# Altium schematic sheet Sixth-Sense-Schematic_2026-08-17.schdoc
size 433 x 310 mm
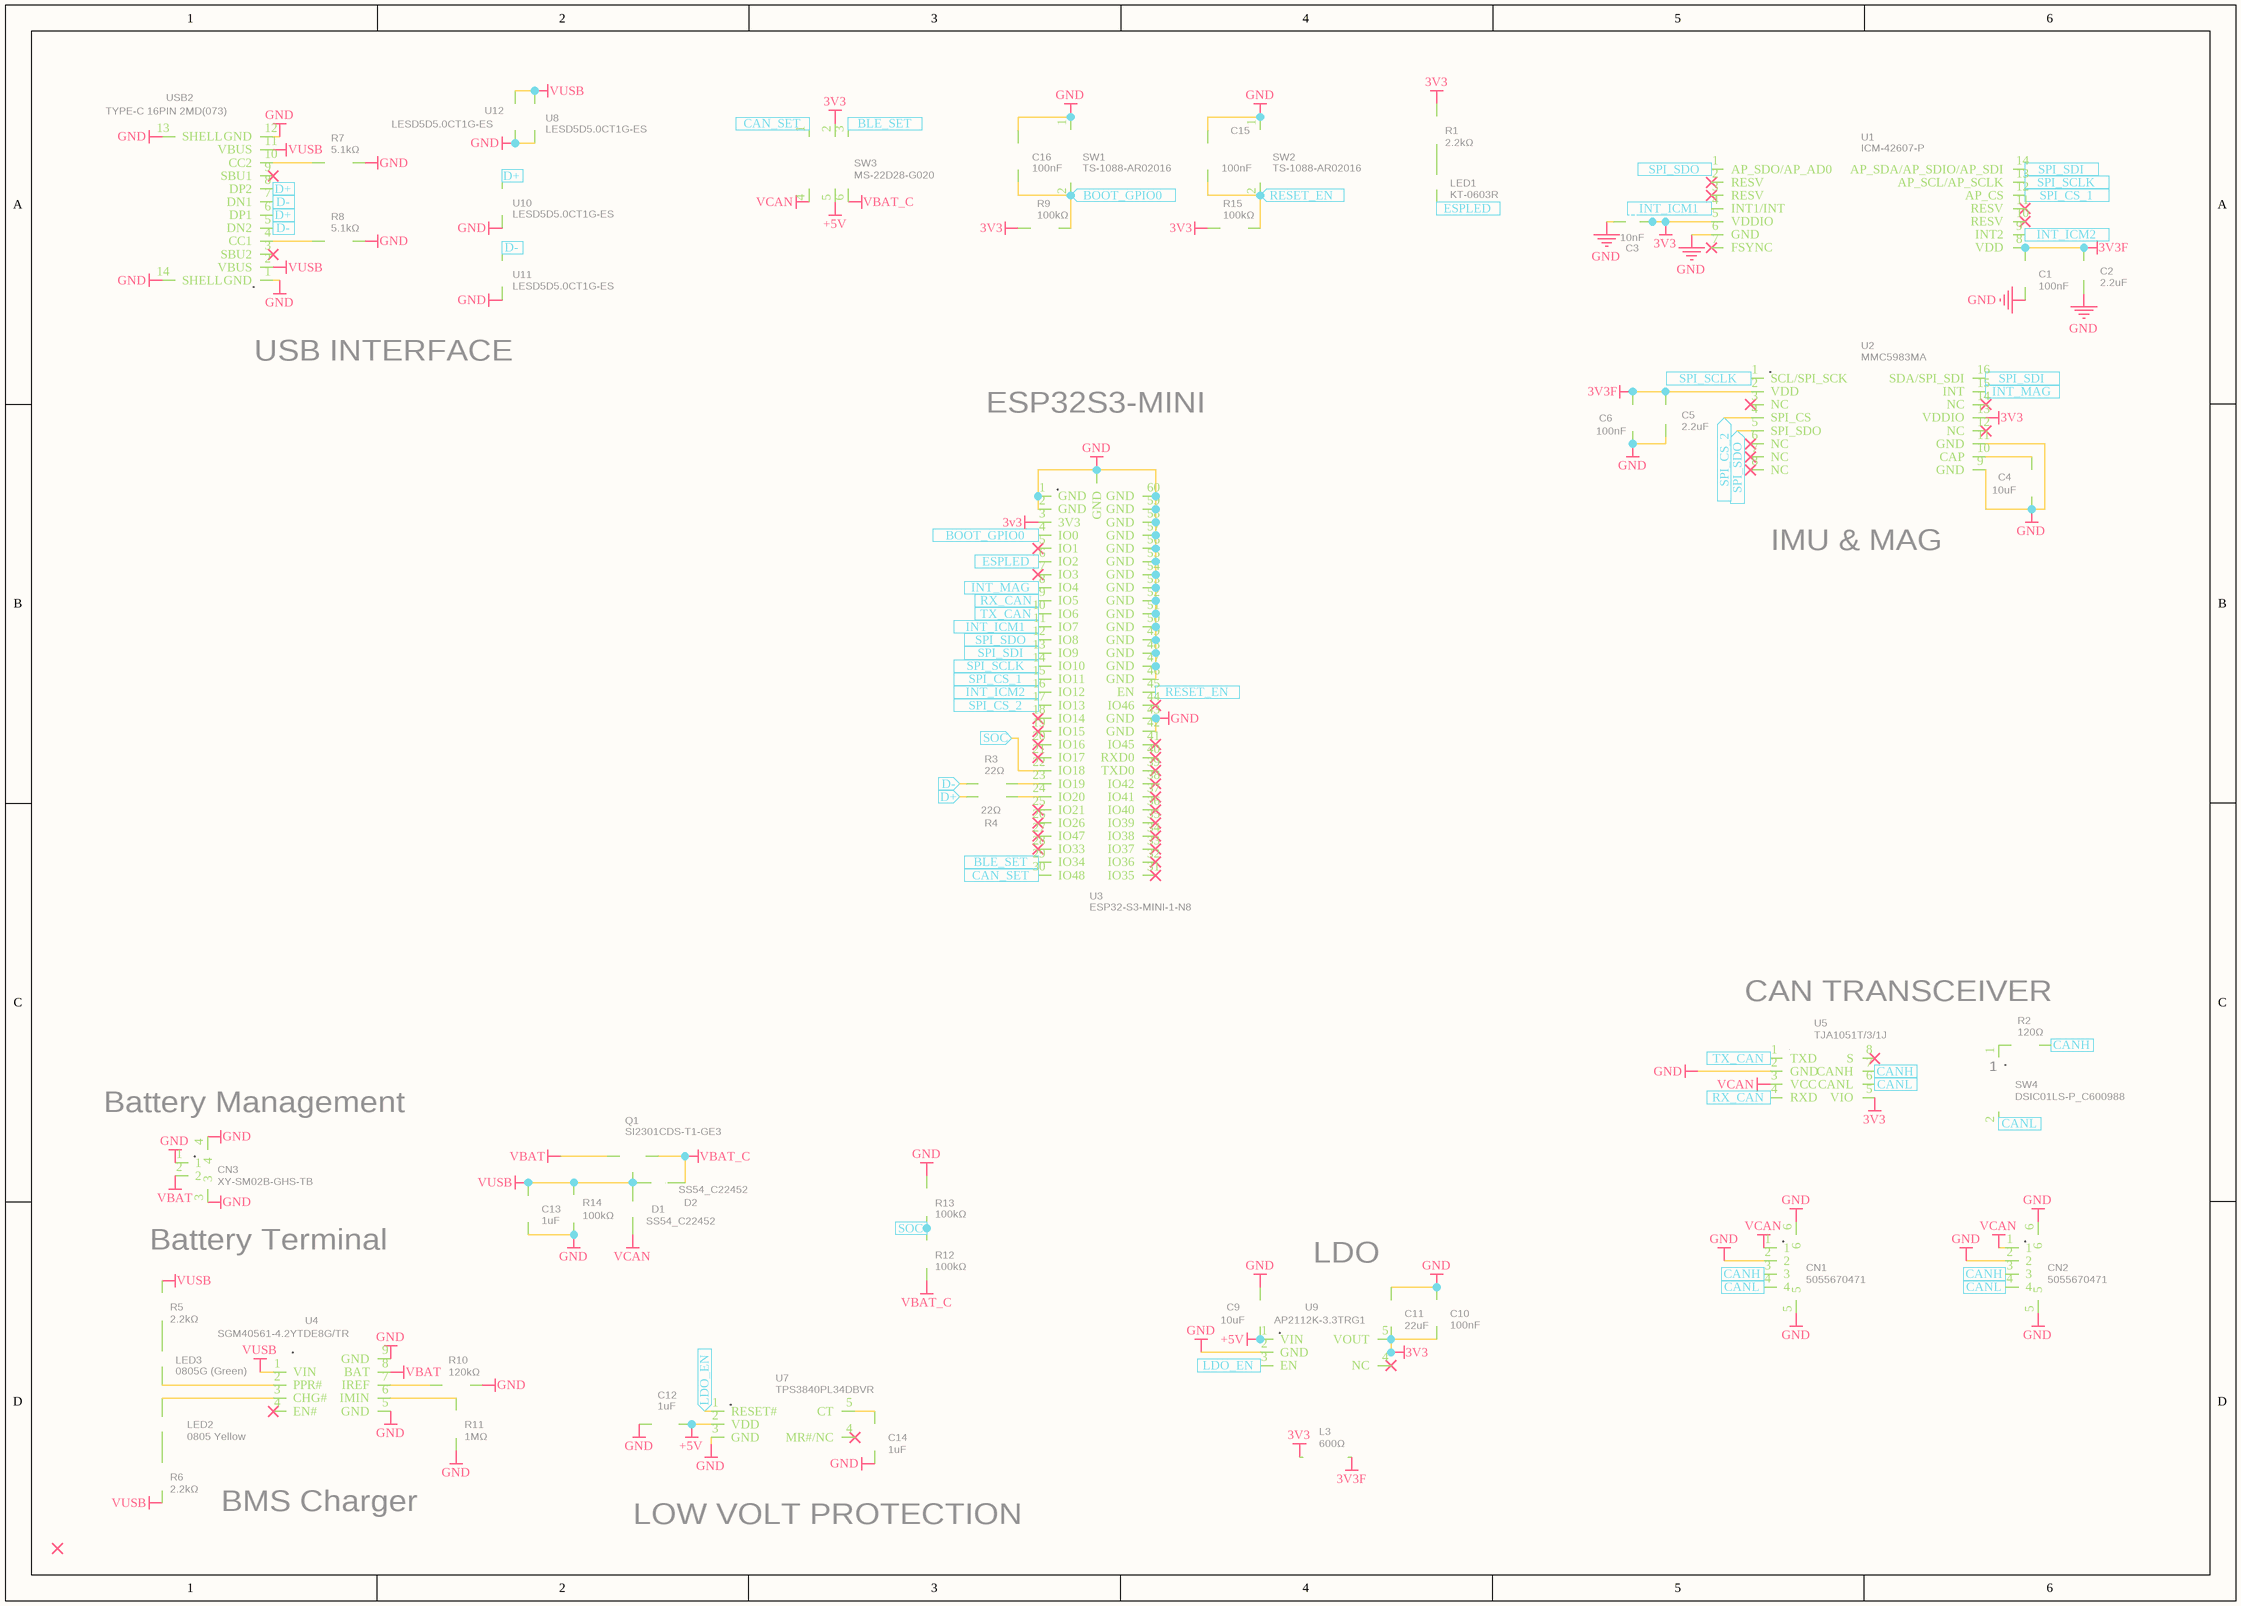
[diagram p0: Sixth-Sense-Schematic_2026-08-17.schdoc]

## Parts
C1  100nF  [C0402]
C2  2.2uF  [C0402]
C3  10nF  [C0402]
C4  10uF  [C0603]
C5  2.2uF  [C0402]
C6  100nF  [C0402]
C9  10uF  [C0603]
C10  100nF  [C0402]
C11  22uF  [C0603]
C12  1uF  [C0402]
C13  1uF  [C0402]
C14  1uF  [C0402]
C15  100nF  [C0603]
C16  100nF  [C0603]
CN1  5055670471  [CONN-SMD_4P-P1.25_MOLEX_5055670471]
CN2  5055670471  [CONN-SMD_4P-P1.25_MOLEX_5055670471]
CN3  XY-SM02B-GHS-TB  [CONN-SMD_SM02B-GHS-TB-LF-SN]
D1  SS54_C22452  [SMA_L4.4-W2.8-LS5.4-R-RD]
D2  SS54_C22452  [SMA_L4.4-W2.8-LS5.4-R-RD]
L3  600Ω  [L0603]
LED1  KT-0603R  [LED-SMD_L1.6-W0.8-R-RD]
LED2  0805 Yellow  [LED0805-R-RD]
LED3  0805G (Green)  [LED0805-R-RD]
Q1  SI2301CDS-T1-GE3  [SOT-23-3_L3.0-W1.7-P0.95-LS2.9-BR]
R1  2.2kΩ  [R0402]
R2  120Ω  [R0402]
R3  22Ω  [R0402]
R4  22Ω  [R0402]
R5  2.2kΩ  [R0402]
R6  2.2kΩ  [R0402]
R7  5.1kΩ  [R0402]
R8  5.1kΩ  [R0402]
R9  100kΩ  [R0402]
R10  120kΩ  [R0402]
R11  1MΩ  [R0402]
R12  100kΩ  [R0402]
R13  100kΩ  [R0402]
R14  100kΩ  [R0402]
R15  100kΩ  [R0402]
SW1  TS-1088-AR02016  [SW-SMD_L3.9-W3.0-P4.45]
SW2  TS-1088-AR02016  [SW-SMD_L3.9-W3.0-P4.45]
SW3  MS-22D28-G020  [SW-SMD_MS-22D28-G020]
SW4  DSIC01LS-P_C600988  [SW-SMD_2P-L3.5-W6.1-P2.54-LS9.8]
U1  ICM-42607-P  [LGA-14_L3.0-W2.5-P0.50-TL_QMI8658A]
U2  MMC5983MA  [LGA-16_L3.0-W3.0-P0.50-BL_SQ]
U3  ESP32-S3-MINI-1-N8  [BULETM-SMD_ESP32-S3-MINI-1-N8]
U4  SGM40561-4.2YTDE8G/TR  [TDFN-8L_L2.0-W2.0-P0.50-BL-EP]
U5  TJA1051T/3/1J  [SOIC-8_L4.9-W3.9-P1.27-LS6.0-BL]
U7  TPS3840PL34DBVR  [SOT-23-5_L3.0-W1.7-P0.95-LS2.8-BR]
U8  LESD5D5.0CT1G-ES  [SOD-523_L1.2-W0.8-LS1.6-BI]
U9  AP2112K-3.3TRG1  [SOT-25-5_L2.9-W1.6-P0.95-LS2.8-BL]
U10  LESD5D5.0CT1G-ES  [SOD-523_L1.2-W0.8-LS1.6-BI]
U11  LESD5D5.0CT1G-ES  [SOD-523_L1.2-W0.8-LS1.6-BI]
U12  LESD5D5.0CT1G-ES  [SOD-523_L1.2-W0.8-LS1.6-BI]
USB2  TYPE-C 16PIN 2MD(073)  [USB-C-SMD_TYPE-C-6PIN-2MD-073]

## Ports
BLE_SET (in), BOOT_GPIO0 (in), CAN_SET (in), CANH (in), CANL (in), D+ (in), D- (in), ESPLED (in), INT_ICM1 (in), INT_ICM2 (in), INT_MAG (in), LDO_EN (in), RESET_EN (in), RX_CAN (in), SOC (in), SPI_CS_1 (in), SPI_CS_2 (in), SPI_SCLK (in), SPI_SDI (in), SPI_SDO (in), TX_CAN (in)

## Nets
3V3: C3.1 C10.1 C11.1 L3.1 R1.2 R9.1 R15.2 SW3.2 U1.5(VDDIO) U2.13(VDDIO) U3.3(3V3) U5.5(VIO) U9.5(VOUT)
3V3F: C1.1 C2.2 C5.2 C6.1 L3.2 U1.8(VDD) U2.2(VDD)
+5V: C9.1 C12.2 SW3.5 U7.2(VDD) U9.1(VIN)
GND: C1.2 C2.1 C3.2 C4.1 C5.1 C6.2 C9.2 C10.2 C11.2 C12.1 C13.1 C14.2 C15.2 C16.2 CN1.2 CN1.5 CN1.6 CN2.2 CN2.5 CN2.6 CN3.1 CN3.3 CN3.4 R7.2 R8.2 R10.2 R11.2 R13.1 R14.1 SW1.1 SW2.1 U1.6(GND) U2.9(GND) U2.11(GND) U3.1(GND) U3.2(GND) U3.42(GND) U3.43(GND) U3.46(GND) U3.47(GND) U3.48(GND) U3.49(GND) U3.50(GND) U3.51(GND) U3.52(GND) U3.53(GND) U3.54(GND) U3.55(GND) U3.56(GND) U3.57(GND) U3.58(GND) U3.59(GND) U3.60(GND) U3.GND U4.5(GND) U4.9(GND) U5.2(GND) U7.3(GND) U8.1 U9.2(GND) U10.1 U11.1 U12.1 USB2.1(GND) USB2.12(GND) USB2.13(SHELL) USB2.14(SHELL)
VBAT: CN3.2 Q1.3(D) U4.8(BAT)
VBAT_C: D1.2(K) Q1.2(S) R12.2 SW3.6
VCAN: CN1.1 CN2.1 D2.2(K) SW3.4 U5.3(VCC)
VUSB: C13.2 D1.1(A) D2.1(A) Q1.1(G) R5.2 R6.1 R14.2 U4.1(VIN) U8.2 U12.2 USB2.2(VBUS) USB2.11(VBUS)
BLE_SET: SW3.3 U3.29(IO34) ; port BLE_SET
BOOT_GPIO0: C16.1 R9.2 SW1.2 U3.4(IO0) ; port BOOT_GPIO0
CAN_SET: SW3.1 U3.30(IO48) ; port CAN_SET
CANH: CN1.3 CN2.3 R2.1 U5.7(CANH) ; port CANH
CANL: CN1.4 CN2.4 SW4.2(PIN2) U5.6(CANL) ; port CANL
D+: R4.2 U10.2 USB2.6(DP1) USB2.8(DP2) ; port D+
D-: R3.1 U11.2 USB2.5(DN2) USB2.7(DN1) ; port D-
ESPLED: LED1.2(K) U3.6(IO2) ; port ESPLED
INT_ICM1: U1.4(INT1/INT) U3.11(IO7) ; port INT_ICM1
INT_ICM2: U1.9(INT2) U3.16(IO12) ; port INT_ICM2
INT_MAG: U2.15(INT) U3.8(IO4) ; port INT_MAG
LDO_EN: U7.1(RESET#) U9.3(EN) ; port LDO_EN
RESET_EN: C15.1 R15.1 SW2.2 U3.45(EN) ; port RESET_EN
RX_CAN: U3.9(IO5) U5.4(RXD) ; port RX_CAN
SOC: R12.1 R13.2 U3.22(IO18) ; port SOC
SPI_CS_1: U1.12(AP_CS) U3.15(IO11) ; port SPI_CS_1
SPI_CS_2: U2.4(SPI_CS) U3.17(IO13) ; port SPI_CS_2
SPI_SCLK: U1.13(AP_SCL/AP_SCLK) U2.1(SCL/SPI_SCK) U3.14(IO10) ; port SPI_SCLK
SPI_SDI: U1.14(AP_SDA/AP_SDIO/AP_SDI) U2.16(SDA/SPI_SDI) U3.13(IO9) ; port SPI_SDI
SPI_SDO: U1.1(AP_SDO/AP_AD0) U2.5(SPI_SDO) U3.12(IO8) ; port SPI_SDO
TX_CAN: U3.10(IO6) U5.1(TXD) ; port TX_CAN
NetC4_2: C4.2 U2.10(CAP)
NetC14_1: C14.1 U7.5(CT)
NetLED1_1: LED1.1(A) R1.1
NetLED2_1: LED2.1(+) R6.2
NetLED2_2: LED2.2(-) U4.3(CHG#)
NetLED3_1: LED3.1(A) R5.1
NetLED3_2: LED3.2(K) U4.2(PPR#)
NetR2_2: R2.2 SW4.1(PIN1)
NetR3_2: R3.2 U3.23(IO19)
NetR4_1: R4.1 U3.24(IO20)
NetR7_1: R7.1 USB2.10(CC2)
NetR8_1: R8.1 USB2.4(CC1)
NetR10_1: R10.1 U4.7(IREF)
NetR11_1: R11.1 U4.6(IMIN)

Not connected (* = marked no-connect by the designer): U1 2(RESV)* 3(RESV)* 7(FSYNC)* 10(RESV)* 11(RESV)*; U2 3(NC)* 6(NC)* 7(NC)* 8(NC)* 12(NC)* 14(NC)*; U3 5(IO1)* 7(IO3)* 18(IO14)* 19(IO15)* 20(IO16)* 21(IO17)* 25(IO21)* 26(IO26)* 27(IO47)* 28(IO33)* 31(IO35)* 32(IO36)* 33(IO37)* 34(IO38)* 35(IO39)* 36(IO40)* 37(IO41)* 38(IO42)* 39(TXD0)* 40(RXD0)* 41(IO45)* 44(IO46)*; U4 4(EN#)*; U5 8(S)*; U7 4(MR#/NC)*; U9 4(NC)*; USB2 3(SBU2)* 9(SBU1)*

## Notes on the sheet
- USB INTERFACE
- ESP32S3-MINI
- IMU & MAG
- CAN TRANSCEIVER
- (near CN3) Battery Management
- Battery Terminal
- LDO
- BMS Charger
- LOW VOLT PROTECTION

## Library data of the parts
C1 C6 C10 = 100nF: Manufacturer Part: CL05B104KO5NNNC; Manufacturer: SAMSUNG(三星); nameAlias: Value; Supplier: LCSC; Supplier Part: C1525; JLCPCB Part Class: Basic Part; spicePre: C; spiceSymbolName: CL05B104KO5NNNC
C2 C5 = 2.2uF: Manufacturer Part: CL05A225MQ5NSNC; Manufacturer: SAMSUNG(三星); nameAlias: Value; Supplier: LCSC; Supplier Part: C12530; JLCPCB Part Class: Basic Part; spicePre: C; spiceSymbolName: CL05A225MQ5NSNC
C3 = 10nF: Manufacturer Part: CL05B103KB5NNNC; Manufacturer: SAMSUNG(三星); nameAlias: Value; Supplier: LCSC; Supplier Part: C15195; JLCPCB Part Class: Basic Part; spicePre: C; spiceSymbolName: CL05B103KB5NNNC
C4 C9 = 10uF: Manufacturer: SAMSUNG(三星); Manufacturer Part: CL10A106KP8NNNC; nameAlias: Value; Supplier: LCSC; Supplier Part: C19702; JLCPCB Part Class: Basic Part; spicePre: C; spiceSymbolName: CL10A106KP8NNNC
C11 = 22uF: Manufacturer: SAMSUNG(三星); Manufacturer Part: CL10A226MQ8NRNC; nameAlias: Value; Supplier: LCSC; Supplier Part: C59461; JLCPCB Part Class: Basic Part; spicePre: C; spiceSymbolName: CL10A226MQ8NRNC
C12-C14 = 1uF: Manufacturer: SAMSUNG(三星); Manufacturer Part: CL05A105KA5NQNC; nameAlias: Value; Supplier: LCSC; Supplier Part: C52923; JLCPCB Part Class: Basic Part; spicePre: C; spiceSymbolName: CL05A105KA5NQNC
C15 C16 = 100nF: Manufacturer: YAGEO(国巨); Manufacturer Part: CC0603KRX7R9BB104; nameAlias: Value; Supplier: LCSC; Supplier Part: C14663; JLCPCB Part Class: Basic Part; spicePre: C; spiceSymbolName: CC0603KRX7R9BB104
CN1 CN2 = 5055670471: Manufacturer: MOLEX; Contributor: lcsc; Supplier: LCSC; Supplier Part: C563985; Manufacturer Part: 5055670471; JLCPCB Part Class: Extended Part; spicePre: C; spiceSymbolName: 5055670471
CN3 = XY-SM02B-GHS-TB: Manufacturer: XYECONN(辛译); Contributor: lcsc; Supplier: LCSC; Supplier Part: C54582897; Manufacturer Part: XY-SM02B-GHS-TB; JLCPCB Part Class: Extended Part; spicePre: C; spiceSymbolName: XY-SM02B-GHS-TB
D1 D2 = SS54_C22452: Manufacturer Part: SS54; Manufacturer: MDD(辰达半导体); Supplier: LCSC; Supplier Part: C22452; JLCPCB Part Class: Basic Part; spicePre: D; spiceSymbolName: SS54_C22452
L3 = 600Ω: Manufacturer: Sunlord(顺络); Manufacturer Part: GZ1608D601TF; nameAlias: Value; Supplier: LCSC; Supplier Part: C1002; JLCPCB Part Class: Basic Part; spicePre: L; spiceSymbolName: GZ1608D601TF
LED1 = KT-0603R: Manufacturer: KENTO; Supplier: LCSC; Manufacturer Part: KT-0603R; Supplier Part: C2286; JLCPCB Part Class: Basic Part; spicePre: L; spiceSymbolName: KT-0603R
LED2 = 0805 Yellow: Manufacturer: KENTO; Manufacturer Part: KT-0805黄灯; Supplier: LCSC; Supplier Part: C2296; JLCPCB Part Class: Basic Part; spicePre: L; spiceSymbolName: 17-21SUYC/TR8
LED3 = 0805G (Green): Manufacturer: KENTO; Manufacturer Part: KT-0805G; Supplier: LCSC; Supplier Part: C2297; JLCPCB Part Class: Basic Part; spicePre: L; spiceSymbolName: 0805G (Green)
Q1 = SI2301CDS-T1-GE3: Manufacturer: VISHAY(威世); Supplier: LCSC; Manufacturer Part: SI2301CDS-T1-GE3; Supplier Part: C10487; JLCPCB Part Class: Basic Part; spicePre: Q; spiceSymbolName: SI2301CDS-T1-GE3
R1 R5 R6 = 2.2kΩ: Manufacturer: UNI-ROYAL(厚声); Manufacturer Part: 0402WGF2201TCE; nameAlias: Value; Supplier: LCSC; Supplier Part: C25879; JLCPCB Part Class: Basic Part; spicePre: R; spiceSymbolName: 0402WGF2201TCE
R2 = 120Ω: Manufacturer: UNI-ROYAL(厚声); Manufacturer Part: 0402WGF1200TCE; nameAlias: Value; Supplier: LCSC; Supplier Part: C25079; JLCPCB Part Class: Basic Part; spicePre: R; spiceSymbolName: 0402WGF1200TCE
R3 R4 = 22Ω: Manufacturer: UNI-ROYAL(厚声); Manufacturer Part: 0402WGF220JTCE; nameAlias: Value; Supplier: LCSC; Supplier Part: C25092; JLCPCB Part Class: Basic Part; spicePre: R; spiceSymbolName: 0402WGF220JTCE
R7 R8 = 5.1kΩ: Manufacturer: UNI-ROYAL(厚声); Manufacturer Part: 0402WGF5101TCE; nameAlias: Value; Supplier: LCSC; Supplier Part: C25905; JLCPCB Part Class: Basic Part; spicePre: R; spiceSymbolName: 0402WGF5101TCE
R9 R12-R15 = 100kΩ: Manufacturer: UNI-ROYAL(厚声); Manufacturer Part: 0402WGF1003TCE; nameAlias: Value; Supplier: LCSC; Supplier Part: C25741; JLCPCB Part Class: Basic Part; spicePre: R; spiceSymbolName: 0402WGF1003TCE
R10 = 120kΩ: Manufacturer: UNI-ROYAL(厚声); Manufacturer Part: 0402WGF1203TCE; nameAlias: Value; Supplier: LCSC; Supplier Part: C25750; JLCPCB Part Class: Extended Part; spicePre: R; spiceSymbolName: 0402WGF1203TCE
R11 = 1MΩ: Manufacturer: UNI-ROYAL(厚声); Manufacturer Part: 0402WGF1004TCE; nameAlias: Value; Supplier: LCSC; Supplier Part: C26083; JLCPCB Part Class: Basic Part; spicePre: R; spiceSymbolName: 0402WGF1004TCE
SW1 SW2 = TS-1088-AR02016: Manufacturer: XUNPU(讯普); Contributor: LCSC; Supplier: LCSC; Supplier Part: C720477; Manufacturer Part: TS-1088-AR02016; JLCPCB Part Class: Basic Part; spicePre: S; spiceSymbolName: TS-1088-AR02016
SW3 = MS-22D28-G020: Manufacturer: G-Switch(品赞); Contributor: LCSC; Supplier: LCSC; Supplier Part: C963205; Manufacturer Part: MS-22D28-G020; JLCPCB Part Class: Extended Part; spicePre: S; spiceSymbolName: MS-22D28-G020
SW4 = DSIC01LS-P_C600988: Manufacturer: XKB Connection(中国星坤); Contributor: LCSC; Supplier: LCSC; Supplier Part: C600988; Manufacturer Part: DSIC01LS-P; JLCPCB Part Class: Extended Part; spicePre: S; spiceSymbolName: DSIC01LS-P_C600988
U1 = ICM-42607-P: Manufacturer: TDK InvenSense(应美盛); Contributor: lcsc; Supplier: LCSC; Supplier Part: C5129967; Manufacturer Part: ICM-42607-P; JLCPCB Part Class: Extended Part; spicePre: U; spiceSymbolName: ICM-42607-P
U2 = MMC5983MA: Manufacturer: MEMSIC(美新); Contributor: LCSC; Supplier: LCSC; Supplier Part: C404329; Manufacturer Part: MMC5983MA; JLCPCB Part Class: Extended Part; spicePre: U; spiceSymbolName: MMC5983MA
U3 = ESP32-S3-MINI-1-N8: Manufacturer: ESPRESSIF(乐鑫); Contributor: lcsc; Supplier: LCSC; Supplier Part: C2913206; Manufacturer Part: ESP32-S3-MINI-1-N8; JLCPCB Part Class: Extended Part; spicePre: U; spiceSymbolName: ESP32-S3-MINI-1-N8
U4 = SGM40561-4.2YTDE8G/TR: Manufacturer: SGMICRO(圣邦微); Contributor: LCSC; Supplier: LCSC; Supplier Part: C82332; Manufacturer Part: SGM40561-4.2YTDE8G/TR; JLCPCB Part Class: Extended Part; spicePre: U; spiceSymbolName: SGM40561-4.2YTDE8G/TR
U5 = TJA1051T/3/1J: Manufacturer: NXP(恩智浦); Supplier: LCSC; Manufacturer Part: TJA1051T/3/1J; Supplier Part: C38695; JLCPCB Part Class: Extended Part; spicePre: U; spiceSymbolName: TJA1051T/3/1J
U7 = TPS3840PL34DBVR: Manufacturer: TI(德州仪器); Contributor: lcsc; Supplier: LCSC; Supplier Part: C2871627; Manufacturer Part: TPS3840PL34DBVR; JLCPCB Part Class: Extended Part; spicePre: U; spiceSymbolName: TPS3840PL34DBVR
U8 U10-U12 = LESD5D5.0CT1G-ES: Manufacturer: ElecSuper(静芯微); Contributor: lcsc; Supplier: LCSC; Supplier Part: C5199159; Manufacturer Part: LESD5D5.0CT1G-ES; JLCPCB Part Class: Extended Part; spicePre: U; spiceSymbolName: LESD5D5.0CT1G-ES
U9 = AP2112K-3.3TRG1: Manufacturer: DIODES(美台); Contributor: LCSC; Supplier: LCSC; Manufacturer Part: AP2112K-3.3TRG1; Supplier Part: C51118; JLCPCB Part Class: Extended Part; spicePre: U; spiceSymbolName: AP2112K-3.3TRG1
USB2 = TYPE-C 16PIN 2MD(073): Manufacturer: SHOU HAN(首韩); Contributor: LCSC; Supplier: LCSC; Supplier Part: C2765186; Manufacturer Part: TYPE-C 16PIN 2MD(073); JLCPCB Part Class: Extended Part; spicePre: U; spiceSymbolName: TYPE-C 16PIN 2MD(073)